# Altium schematic sheet Converter.SchDoc
size A4
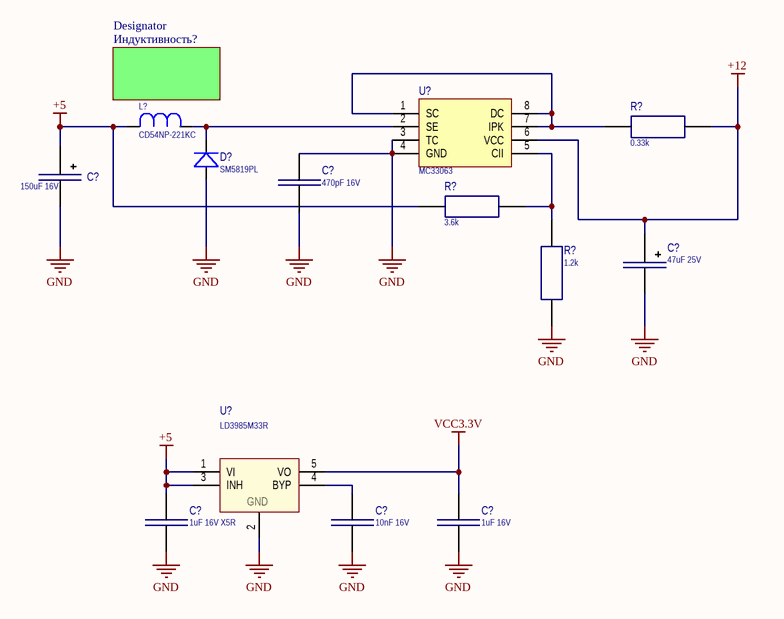
[diagram p0: Converter.SchDoc]

## Parts
(Parts that share a designator on the sheet are numbered #1, #2 ... from top to bottom, then left to right.)
C?#1  150uF 16V  [CPM7343]
C?#2  470pF 16V  [C_0805]
C?#3  47uF 25V  [CPM7343]
C?#4  1uF 16V X5R  [C_0603]
C?#5  10nF 16V  [C_0603]
C?#6  1uF 16V  [C_0603]
D?  SM5819PL  [SOD-123]
L?  CD54NP-221KC  [CD54NP]
R?#1  0.33k  [R_0805]
R?#2  3.6k  [R_0805]
R?#3  1.2k  [R_0805]
U?#1  MC33063  [SO-8]
U?#2  LD3985M33R  [SOT23-5]

## Sub-sheets
Designator = Индуктивность?: no entries

## Nets
+5: C?#1.1 C?#4.2 L?.2 R?#2.2 U?#2.1(VI) U?#2.3(INH)
+12: C?#3.1 R?#1.1 U?#1.6(VCC)
GND: C?#1.2 C?#2.1 C?#2.2 C?#3.2 C?#4.1 C?#5.1 C?#6.1 D?.1(A) R?#3.2 U?#1.3(TC) U?#1.4(GND) U?#2.2(GND)
VCC3.3V: C?#6.2 U?#2.5(VO)
NetC?#5_2: C?#5.2 U?#2.4(BYP)
NetD?_2: D?.2(K) L?.1 U?#1.2(SE)
NetR?#1_2: R?#1.2 U?#1.1(SC) U?#1.7(IPK) U?#1.8(DC)
NetR?#2_1: R?#2.1 R?#3.1 U?#1.5(CII)

## Library data of the parts
C?#1 = CPM7343: Capacitor; Value: 150uF 16V
C?#2 = C0805: Capacitor; Value: 470pF 16V
C?#3 = CPM7343H: Capacitor; Value: 47uF 25V
C?#4-C?#6 = C0603: Capacitor
  C?#4: Value: 1uF 16V X5R
  C?#5: Value: 10nF 16V
  C?#6: Value: 1uF 16V
D? = D_SOD123: Diode
L? = L_CD54NP: Inductor; Value: CD54NP-221KC
R?#1-R?#3 = R0805: Resistor
  R?#1: Value: 0.33k
  R?#2: Value: 3.6k
  R?#3: Value: 1.2k
U?#1 = MC33063: Step-up/down IC